# EAGLE design mcp23017_L298 (EAGLE 6.4)
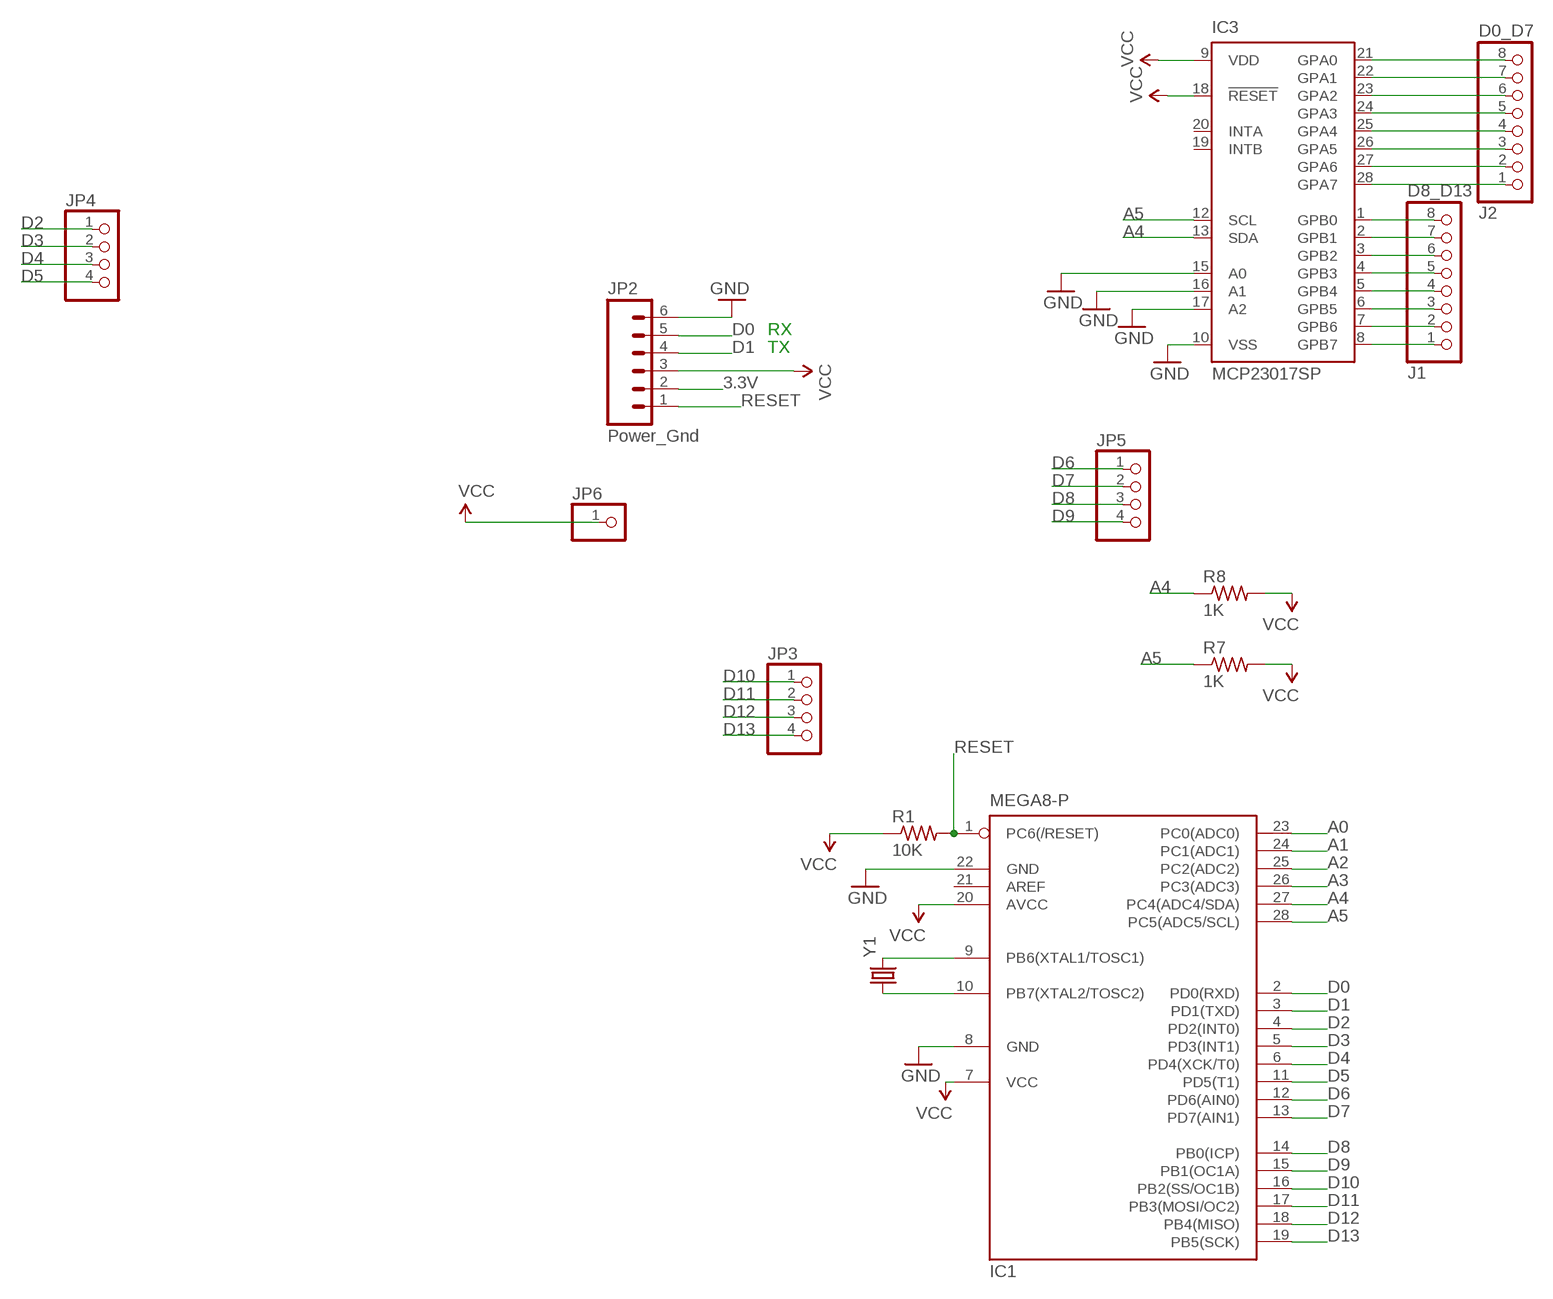
[diagram p0: schematic, sheet 1]

## Parts
IC1  MEGA8-P  [DIL28-3]
IC3  MCP23017SP  [DIL28-3]
J1  D8_D13  PINHD-1X8  [1X08]
J2  D0_D7  PINHD-1X8  [1X08]
JP2  Power_Gnd  M06SIP  [1X06]
JP3  PINHD-1X4  [1X04]
JP4  PINHD-1X4  [1X04]
JP5  PINHD-1X4  [1X04]
JP6  PINHD-1X1  [1X01]
R1  10K  R-US_0207/10  [0207/10]
R7  1K  R-US_0207/10  [0207/10]
R8  1K  R-US_0207/10  [0207/10]
Y1  CRYSTALHC49US  [HC49US]

## Nets
3.3V: JP2.2
A0: IC1.23(PC0(ADC0))
A1: IC1.24(PC1(ADC1))
A2: IC1.25(PC2(ADC2))
A3: IC1.26(PC3(ADC3))
A4: IC1.27(PC4(ADC4/SDA)) IC3.13(SDA) R8.1
A5: IC1.28(PC5(ADC5/SCL)) IC3.12(SCL) R7.1
D0: IC1.2(PD0(RXD)) JP2.5
D1: IC1.3(PD1(TXD)) JP2.4
D2: IC1.4(PD2(INT0)) JP4.1
D3: IC1.5(PD3(INT1)) JP4.2
D4: IC1.6(PD4(XCK/T0)) JP4.3
D5: IC1.11(PD5(T1)) JP4.4
D6: IC1.12(PD6(AIN0)) JP5.1
D7: IC1.13(PD7(AIN1)) JP5.2
D8: IC1.14(PB0(ICP)) JP5.3
D9: IC1.15(PB1(OC1A)) JP5.4
D10: IC1.16(PB2(SS/OC1B)) JP3.1
D11: IC1.17(PB3(MOSI/OC2)) JP3.2
D12: IC1.18(PB4(MISO)) JP3.3
D13: IC1.19(PB5(SCK)) JP3.4
GND [gnd]: IC1.8(GND) IC1.22(GND) IC3.10(VSS) IC3.15(A0) IC3.16(A1) IC3.17(A2) JP2.6
N$1: IC3.8(GPB7) J1.1
N$2: IC3.7(GPB6) J1.2
N$3: IC3.6(GPB5) J1.3
N$4: IC3.5(GPB4) J1.4
N$5: IC3.4(GPB3) J1.5
N$6: IC3.3(GPB2) J1.6
N$7: IC3.2(GPB1) J1.7
N$8: IC3.1(GPB0) J1.8
N$9: IC3.28(GPA7) J2.1
N$10: IC1.9(PB6(XTAL1/TOSC1)) Y1.2
N$11: IC1.10(PB7(XTAL2/TOSC2)) Y1.1
N$12: IC3.27(GPA6) J2.2
N$13: IC3.26(GPA5) J2.3
N$14: IC3.25(GPA4) J2.4
N$15: IC3.24(GPA3) J2.5
N$16: IC3.23(GPA2) J2.6
N$17: IC3.22(GPA1) J2.7
N$18: IC3.21(GPA0) J2.8
RESET: IC1.1(PC6(/RESET)) JP2.1 R1.2
VCC: IC1.7(VCC) IC1.20(AVCC) IC3.9(VDD) IC3.18(!RESET) JP2.3 JP6.1 R1.1 R7.2 R8.2
Unconnected: IC1.21(AREF) IC3.19(INTB) IC3.20(INTA)

## Notes on the sheet
- RX
- TX

## Library data of the parts
IC1 = atmel:MEGA8-P: MICROCONTROLLER 8 Kbytes FLASH, 1 kbytes SRAM, 512 bytes EEPROM, USART, 4-channel 10 bit ADC, 2-channel 8 bit ADC Pin compatible with Atmega48, ATMega88, ATMega168 Source: avr.lbr; OC_FARNELL: unknown; OC_NEWARK: unknown
IC3 = microchip:MCP23017: http://ww1.microchip.com/downloads/en/DeviceDoc/21952a.pdf Source: http://ww1.microchip.com/downloads/en/DeviceDoc/21952a.pdf; MF: MICROCHIP; MPN: MCP23017-E/SP; OC_FARNELL: 1332088; OC_NEWARK: 31K2959
J1 J2 = pinhead:PINHD-1X8: PIN HEADER
JP2 = SparkFun:M06: Header 6 Standard 6-pin 0.1" header. Use with straight break away headers (SKU : PRT-00116), right angle break away headers (PRT-00553), swiss pins (PRT-00743), machine pins (PRT-00117), and female headers (PRT-00115). Molex polarized connector foot print use with SKU : PRT-08094 with associated crimp pins and housings. NOTES ON THE VARIANTS LOCK and LOCK_LONGPADS... This footprint was designed to help hold the alignment of a through-hole component (i.e. 6-pin header) while soldering it into place. You may notice that each hole has been shifted either up or down by 0.005 of an inch from it's more standard position (which is a perfectly straight line). This slight alteration caused the pins (the squares in the middle) to touch the edges of the holes. Because they are alternating, it causes a "brace" to hold the component in place. 0.005 has proven to be the perfect amount of "off-center" position when using our standard breakaway headers. Although looks a little odd when you look at the bare footprint, once you have a header in there, the alteration is very hard to notice. Also, if you push a header all the way into place, it is covered up entirely on the bottom side. This idea of altering the position of holes to aid alignment will be further integrated into the Sparkfun Library for other footprints. It can help hold any component with 3 or more connection pins.
JP3-JP5 = pinhead:PINHD-1X4: PIN HEADER
JP6 = pinhead:PINHD-1X1: PIN HEADER
R1 R7 R8 = resistor:R-US_: RESISTOR, American symbol
Y1 = SparkFun-FreqCtrl:CRYSTAL: Various standard crystals. Proven footprints. Spark Fun Electronics SKU : COM-00534

## Net classes
0 default: width 0.254 mm, clearance 0.254 mm
1 power: width 0.61 mm, drill 0.711 mm, clearance 0.33 mm
2 gnd: width 0.305 mm, drill 0.711 mm, clearance 0.254 mm
3 usbvcc: width 0.508 mm, drill 0.711 mm, clearance 0.254 mm
4 aref: width 0.406 mm

## Board
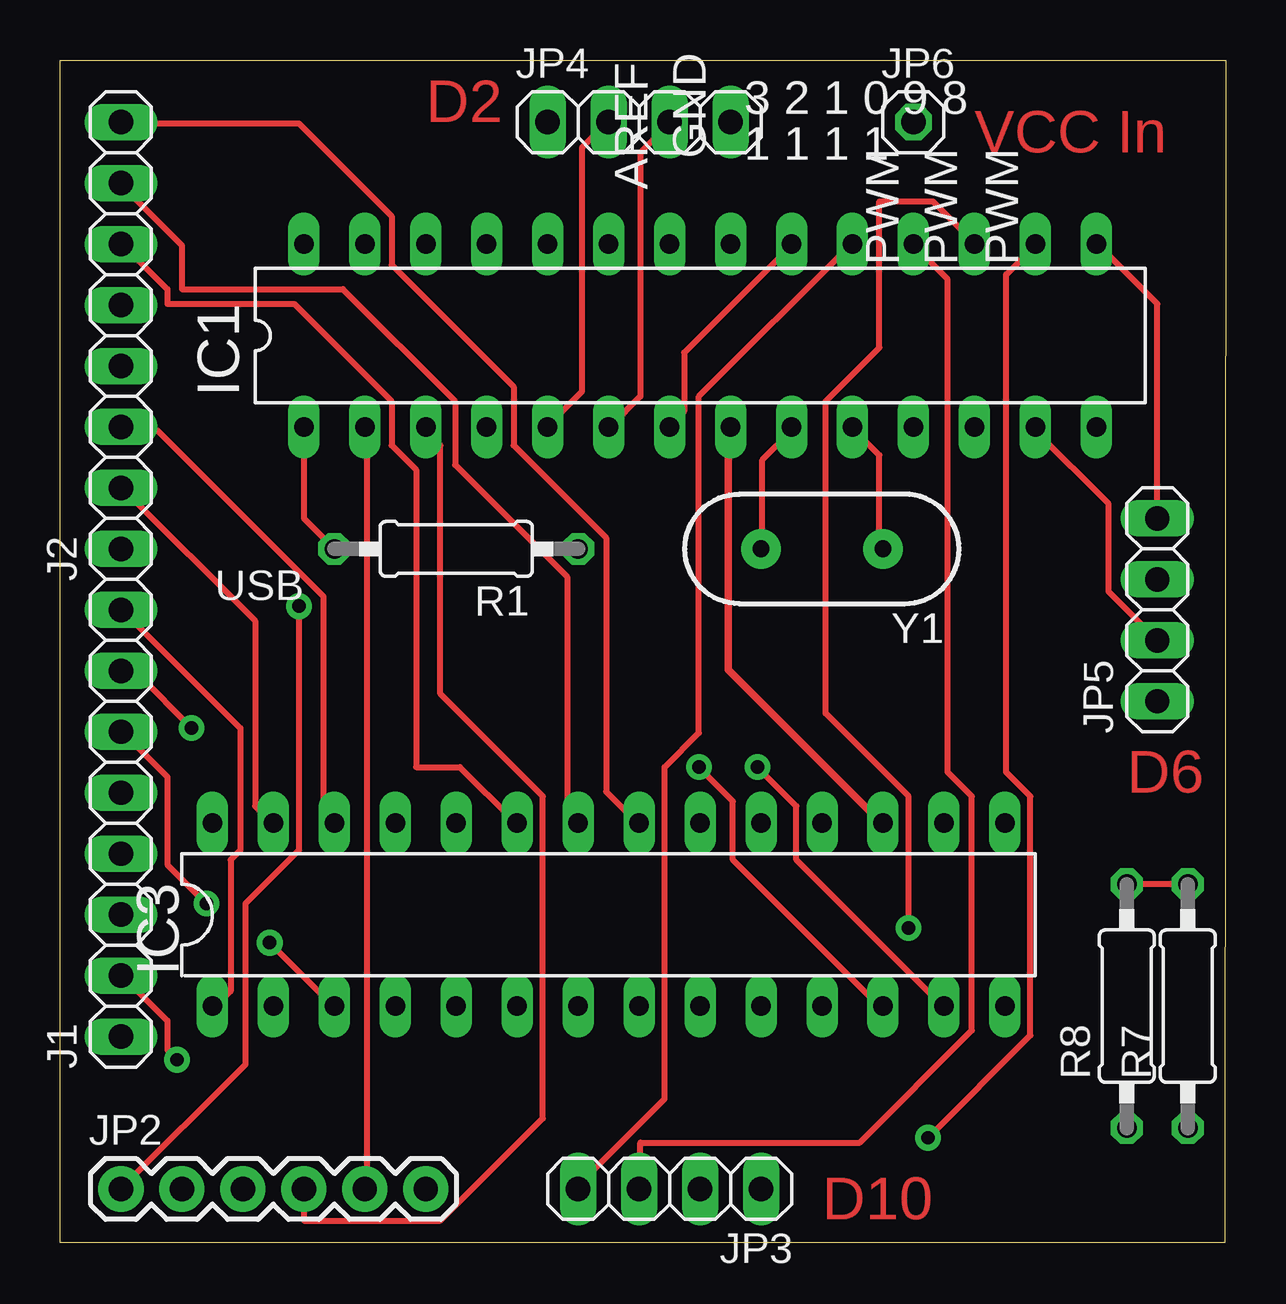
[diagram p1: board, top side]
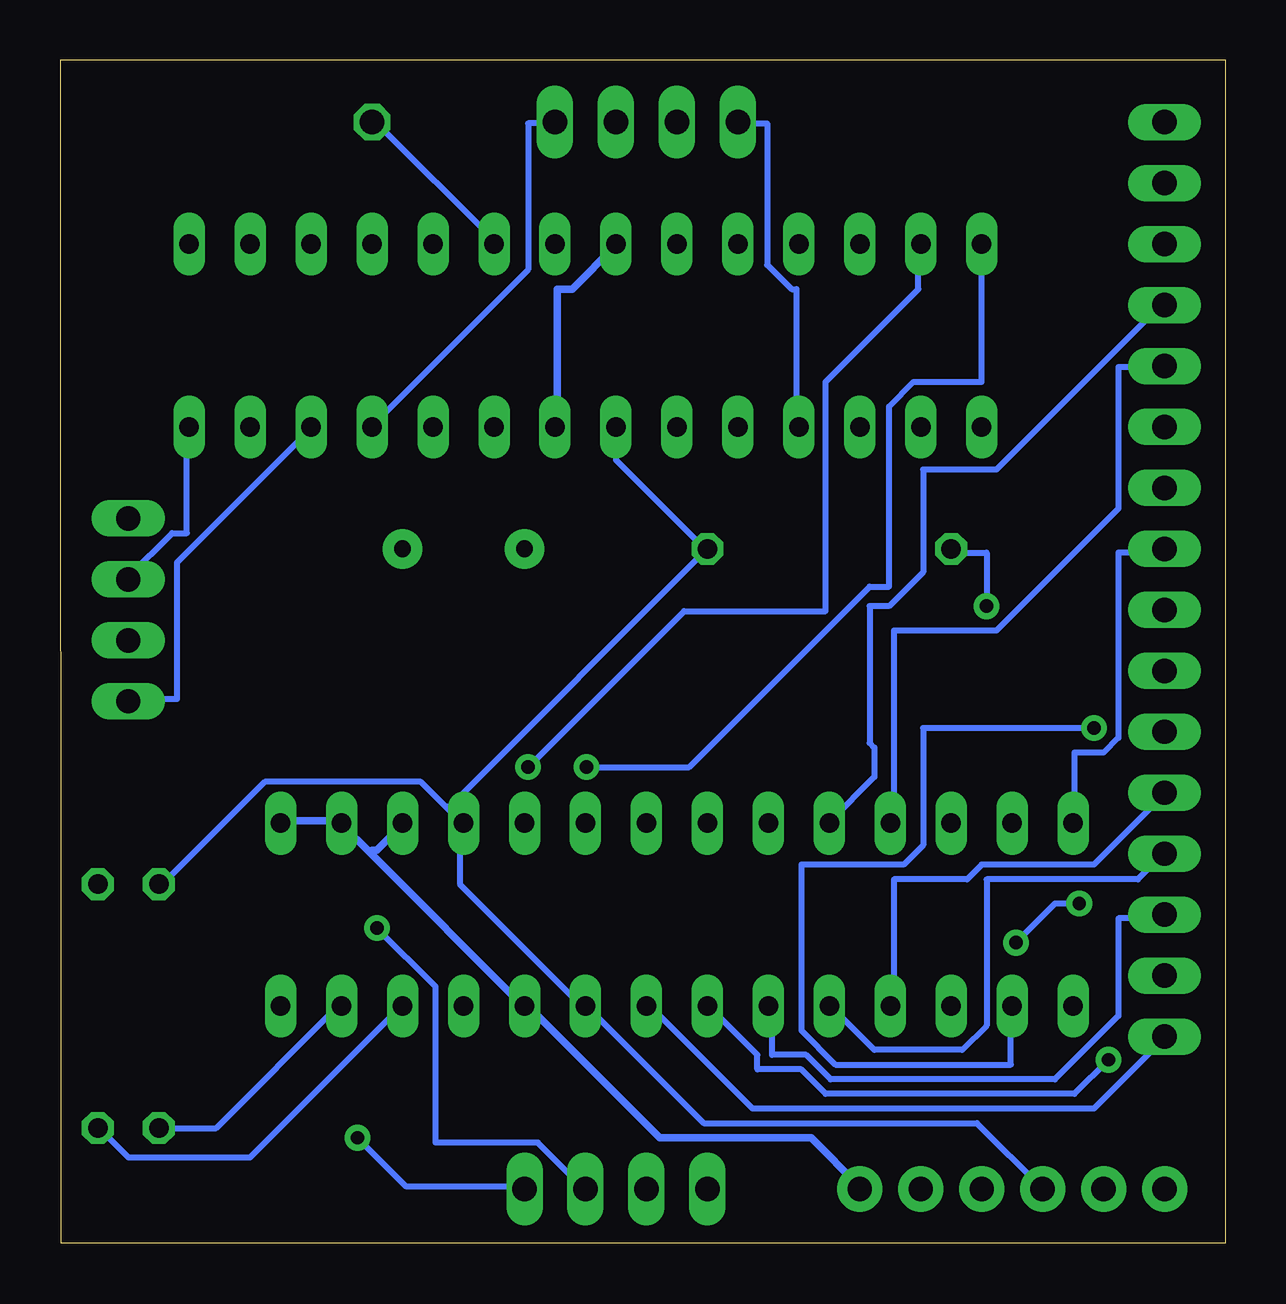
[diagram p2: board, bottom side, seen from below]

Size 48.56 x 49.28 mm. Coordinates in mm from the lower left corner, seen from the top.
Outline: 0,49.28 48.56,49.28 48.54,0 0,0 0,49.28
Copper layers (1*16): Top 0.035mm / dielectric 1.5mm / Bottom 0.035mm
Design rules "default": minimum track width 10mil, minimum drill 22mil, track to track 10mil, track to pad 10mil, pad to pad 10mil, via to via 16mil, smd to smd 8mil, copper to edge 30mil, drill to drill 12mil, minimum pad ring 10mil, minimum via ring 10mil, stop-mask expansion 4mil, vias tented up to drill 0mil, thermal gap 10mil
vRestrict: area 25.4,45.2 to 27.1,48.8; area 33.4,40.7 to 34.9,44.3; area 35.9,40.7 to 37.5,44.3; area 38.5,40.7 to 40,44.3; area 42.5,38.3 to 43.1,38.6

### Footprints (pad centres in the part's own frame; a part is rotated, then mirrored left to right if it is on the bottom)
DIL28-3 = drill 0.813 long: 1 -16.51,-3.81; 2 -13.97,-3.81; 3 -11.43,-3.81; 4 -8.89,-3.81; 5 -6.35,-3.81; 6 -3.81,-3.81; 7 -1.27,-3.81; 8 1.27,-3.81; 9 3.81,-3.81; 10 6.35,-3.81; 11 8.89,-3.81; 12 11.43,-3.81; 13 13.97,-3.81; 14 16.51,-3.81; 15 16.51,3.81; 16 13.97,3.81; 17 11.43,3.81; 18 8.89,3.81; 19 6.35,3.81; 20 3.81,3.81; 21 1.27,3.81; 22 -1.27,3.81; 23 -3.81,3.81; 24 -6.35,3.81; 25 -8.89,3.81; 26 -11.43,3.81; 27 -13.97,3.81; 28 -16.51,3.81
1X08 = drill 1.016 long: 1 -8.89,0; 2 -6.35,0; 3 -3.81,0; 4 -1.27,0; 5 1.27,0; 6 3.81,0; 7 6.35,0; 8 8.89,0
1X06 = drill 1.016 pad 1.88: 1 0,0; 2 2.54,0; 3 5.08,0; 4 7.62,0; 5 10.16,0; 6 12.7,0
1X04 = drill 1.016 long: 1 -3.81,0; 2 -1.27,0; 3 1.27,0; 4 3.81,0
1X01 = drill 1.016 octagon: 1 0,0
0207/10 = drill 0.813 octagon: 1 -5.08,0; 2 5.08,0
HC49US = drill 0.7 pad 1.651: 1 -2.54,0; 2 2.54,0

### Placement (x,y rotation side)
IC1  26.67,37.8 0 top
IC3  22.86,13.67 0 top
J1  2.54,17.48 90 top
J2  2.54,37.8 90 top
JP2  2.54,2.24 0 top
JP3  25.4,2.24 180 top
JP4  24.13,46.69 0 top
JP5  45.72,26.37 90 top
JP6  35.56,46.69 0 top
R1  16.51,28.91 180 top
R7  46.99,9.86 90 top
R8  44.45,9.86 90 top
Y1  31.75,28.91 180 top

### Tracks (layer width: path | path; a pad name or v marks a point on that pad's centre or on a via)
A4  (via drill 0.56)
  Top 0.254: v29.06,19.81 30.68,18.19 30.68,15.95 36.78,9.86 IC3.13
  Bottom 0.254: R8.1 42.06,4.78 36.98,9.86 IC3.13 | v29.06,19.81 22.55,26.31 16.66,26.31 16.66,35.87 12.8,39.73 12.8,41.55 IC1.27
A5  (via drill 0.56)
  Top 0.254: v26.62,19.81 28.04,18.39 28.04,15.95 34.14,9.86 IC3.12
  Bottom 0.254: IC3.12 34.34,9.86 40.64,3.56 45.72,3.56 46.94,4.78 R7.1 | IC1.28 10.16,35.87 13.01,35.87 14.02,34.85 14.02,27.33 14.83,27.33 22.35,19.81 v26.62,19.81
D0
  Top 0.254: IC1.2 12.8,33.83 12.8,2.34 JP2.5
D1
  Top 0.254: JP2.4 10.16,0.91 15.85,0.91 20.12,5.18 20.12,18.59 15.85,22.86 15.85,33.22 15.24,33.83 IC1.3
D2
  Bottom 0.254: IC1.4 17.88,34.04 17.88,39.73 18.09,39.73 19.1,40.74 19.1,46.63 20.32,46.63 JP4.1
D3
  Top 0.254: IC1.5 20.32,34.04 21.74,35.46 21.74,45.62 22.76,46.63 JP4.2
D4
  Top 0.254: IC1.6 22.96,34.04 24.18,35.26 24.18,45.42 25.4,46.63 JP4.3
D5
  Bottom 0.254: IC1.11 35.56,34.04 29.06,40.54 29.06,46.63 28.04,46.63 JP4.4
D6
  Bottom 0.254: IC1.12 38.2,33.83 43.69,28.35 43.69,22.66 45.72,22.66 JP5.1
D7
  Top 0.254: JP5.2 43.69,27.13 43.69,30.79 40.64,33.83 IC1.13
D8
  Bottom 0.254: IC1.14 43.28,33.83 43.28,29.57 43.89,29.57 45.72,27.74 JP5.3
D9
  Top 0.254: JP5.4 45.72,39.12 43.28,41.55 IC1.15
D10  (via drill 0.56)
  Top 0.254: v36.17,4.37 40.44,8.64 40.44,18.59 39.42,19.61 39.42,40.34 40.64,41.55 IC1.16
  Bottom 0.254: v36.17,4.37 34.14,2.34 29.26,2.34 JP3.1
D11  (via drill 0.56)
  Top 0.254: v35.36,13.11 35.36,18.59 31.9,22.05 31.9,35.05 34.14,37.29 34.14,43.38 36.37,43.38 38,41.76 IC1.17
  Bottom 0.254: v35.36,13.11 32.92,10.67 32.92,4.17 28.65,4.17 26.82,2.34 JP3.2
D12
  Top 0.254: IC1.18 35.56,41.55 36.98,40.13 36.98,19.61 38,18.59 38,8.84 33.33,4.17 24.18,4.17 24.18,2.34 JP3.3
D13
  Top 0.254: IC1.19 32.92,41.55 26.62,35.26 26.62,21.23 25.2,19.81 25.2,5.99 21.74,2.54 21.74,2.34 JP3.4
GND
  Top 0.305: 28.04,34.04 IC1.8 27.84,33.83 27.84,23.88 34.14,17.58 IC3.17 | 25.4,41.55 IC1.22
  Bottom 0.305: IC1.8 27.84,34.04 27.84,39.73 27.23,39.73 25.4,41.55 IC1.22 | 35.66,16.26 36.78,17.37 IC3.16 36.98,17.58 39.22,17.58 IC3.15 | 35.66,16.26 29.26,9.86 IC3.10 29.06,9.86 23.57,4.37 17.27,4.37 15.24,2.34 JP2.6 | IC3.17 34.34,17.37 35.36,16.36 35.56,16.36 35.66,16.26
N$1
  Bottom 0.254: IC3.8 23.98,9.86 19.71,5.59 5.49,5.59 2.64,8.43 J1.1
N$2  (via drill 0.56)
  Top 0.254: v4.88,7.62 4.47,8.03 4.47,9.25 2.64,11.07 J1.2
  Bottom 0.254: v4.88,7.62 6.3,6.2 16.66,6.2 17.68,7.21 19.51,7.21 19.51,7.82 21.54,9.86 IC3.7
N$3
  Bottom 0.254: IC3.6 18.9,9.86 18.9,7.82 17.48,7.82 16.46,6.81 7.11,6.81 4.47,9.45 4.47,13.51 2.64,13.51 J1.3
N$4
  Bottom 0.254: IC3.5 16.46,9.86 14.63,8.03 10.97,8.03 9.96,9.04 9.96,15.14 3.66,15.14 2.64,16.15 J1.4
N$5
  Bottom 0.254: IC3.4 13.82,9.86 13.82,15.14 10.77,15.14 10.16,15.75 5.49,15.75 2.64,18.59 J1.5
N$6  (via drill 0.56)
  Top 0.254: v8.74,12.5 11.38,9.86 IC3.3 | v6.1,14.12 4.47,15.75 4.47,19.41 2.64,21.23 J1.6
  Bottom 0.254: v8.74,12.5 7.11,14.12 v6.1,14.12
N$7  (via drill 0.56)
  Top 0.254: v5.49,21.44 3.25,23.67 2.64,23.67 J1.7
  Bottom 0.254: v5.49,21.44 12.6,21.44 12.6,16.56 13.41,15.75 17.68,15.75 17.68,8.84 16.26,7.42 8.94,7.42 8.94,9.86 IC3.2
N$8
  Top 0.254: IC3.1 6.5,9.86 7.11,10.47 7.11,15.95 7.52,16.36 7.52,21.44 2.64,26.31 J1.8
N$9
  Bottom 0.254: IC3.28 6.3,17.58 6.3,20.42 5.08,20.42 4.47,21.03 4.47,28.75 2.64,28.75 J2.1
N$10
  Top 0.254: IC1.9 30.48,33.83 29.26,32.61 29.26,28.96 Y1.2
N$11
  Top 0.254: IC1.10 33.12,33.83 34.14,32.82 34.14,28.96 Y1.1
N$12
  Top 0.254: IC3.27 8.74,17.58 8.13,18.19 8.13,25.91 2.64,31.39 J2.2
N$13
  Top 0.254: IC3.26 11.38,17.58 10.97,17.98 10.97,26.92 4.06,33.83 2.64,33.83 J2.3
N$14
  Bottom 0.254: IC3.25 13.82,17.58 13.82,25.5 9.55,25.5 4.47,30.58 4.47,36.47 2.64,36.47 J2.4
N$15
  Bottom 0.254: IC3.24 16.46,17.58 14.63,19.41 14.63,20.63 14.83,20.83 14.83,26.52 14.02,26.52 12.6,27.94 12.6,32.21 9.55,32.21 2.85,38.91 2.64,38.91 J2.5
N$16
  Top 0.254: IC3.23 18.9,17.58 16.66,19.81 14.83,19.81 14.83,32.21 13.82,33.22 13.82,35.05 9.75,39.12 4.47,39.12 4.47,39.73 2.64,41.55 J2.6
N$17
  Top 0.254: IC3.22 21.54,17.58 21.13,17.98 21.13,27.74 16.46,32.41 16.46,35.05 11.79,39.73 5.08,39.73 5.08,41.55 2.64,43.99 J2.7
N$18
  Top 0.254: IC3.21 23.98,17.58 22.76,18.8 22.76,29.36 18.9,33.22 18.9,35.66 13.82,40.74 13.82,42.77 9.96,46.63 2.64,46.63 J2.8
RESET  (via drill 0.56)
  Top 0.254: R1.2 10.16,30.18 IC1.1 | JP2.1 7.72,7.42 7.72,14.12 9.96,16.36 v9.96,26.52
  Bottom 0.254: v9.96,26.52 9.96,28.75 11.38,28.75 R1.2
VCC
  Top 0.254: IC1.7 25.4,34.04 26.01,34.65 26.01,37.08 30.48,41.55 IC1.20 | R7.2 R8.2
  Bottom 0.254: IC1.7 25.4,32.61 21.74,28.96 R1.1 32.31,18.19 32.51,18.19 | IC1.20 30.48,41.76 35.36,46.63 35.56,46.63 JP6.1 | 32.51,18.19 31.9,17.58 IC3.18 31.9,17.37 31.9,14.94 26.82,9.86 IC3.9 26.62,9.86 21.74,4.98 10.36,4.98 JP2.3 | 32.51,18.19 33.53,19.2 40.03,19.2 44.3,14.94 R8.2

### Text on the board
Top: D2 | VCC In | D6 | D10
tNames: 3 2 1 0 9 8 | GND | 1 1 1 1 | AREF | PWM | PWM | PWM | USB
Reference: C8 | C2 | R11 | C4 | C5